# Altium schematic sheet 06_USB_Interface.SchDoc
size A4; SheetNumber: 7; SheetTotal: 9
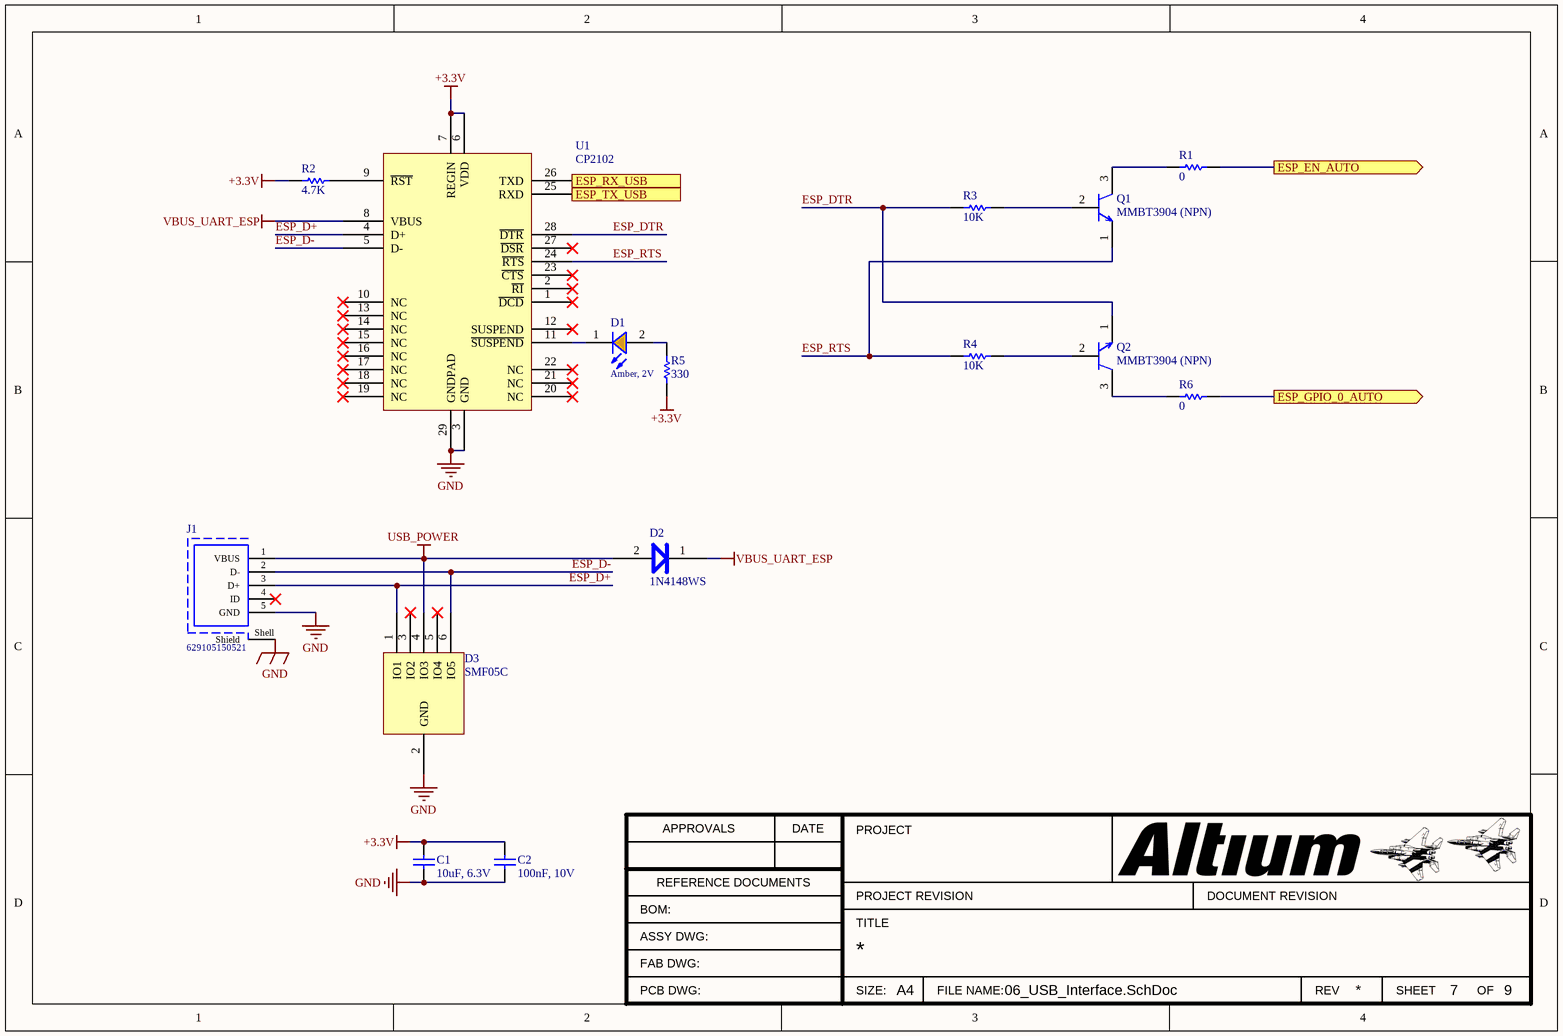
[diagram p0: 06_USB_Interface.SchDoc]

## Parts
C1  10uF, 6.3V  [WCAP-CSGP_0603_H=0.8mm_Reflow]
C2  100nF, 10V  [WCAP-CSGP_0603_H=0.8mm_Reflow]
D1  Amber, 2V  [WL-SMCW_0603_H=0.7mm]
D2  1N4148WS  [SODFL250X90-2N]
D3  SMF05C  [SOT65P210X110-6N]
J1  629105150521  [629105150521]
Q1  MMBT3904 (NPN)  [SOT95P245X110-3N]
Q2  MMBT3904 (NPN)  [SOT95P245X110-3N]
R1  value 0  [RES-SM-0603]  (hidden comment: RESISTOR SMD)
R2  value 4.7K  [RES-SM-0603]  (hidden comment: RESISTOR SMD)
R3  value 10K  [RES-SM-0603]  (hidden comment: RESISTOR SMD)
R4  value 10K  [RES-SM-0603]  (hidden comment: RESISTOR SMD)
R5  value 330  [RES-SM-0603]  (hidden comment: RESISTOR SMD)
R6  value 0  [RES-SM-0603]  (hidden comment: RESISTOR SMD)
U1  CP2102  [QFN50P500X500X90_HS-29N]

## Ports
ESP_EN_AUTO (out), ESP_GPIO_0_AUTO (out), ESP_RX_USB (out), ESP_TX_USB (in)

## Nets
+3.3V: C1.2 C2.2 R2.2 R5.2 U1.6(VDD) U1.7(REGIN)
GND: C1.1 C2.1 D3.2(GND) J1.5(GND) J1.Shell(Shield) U1.3(GND) U1.29(GNDPAD)
USB_POWER: D2.2 D3.4(IO3) J1.1(VBUS)
VBUS_UART_ESP: D2.1 U1.8(VBUS)
ESP_D+: D3.1(IO1) J1.3(D+) U1.4(D+)
ESP_D-: D3.6(IO5) J1.2(D-) U1.5(D-)
ESP_DTR: Q2.1 R3.1 U1.28(~{DTR})
ESP_EN_AUTO: R1.2 ; port ESP_EN_AUTO
ESP_GPIO_0_AUTO: R6.2 ; port ESP_GPIO_0_AUTO
ESP_RTS: Q1.1 R4.1 U1.24(~{RTS})
ESP_RX_USB: U1.26(TXD) ; port ESP_RX_USB
ESP_TX_USB: U1.25(RXD) ; port ESP_TX_USB
NetD1_1: D1.1(K) U1.11(~{SUSPEND})
NetD1_2: D1.2(A) R5.1
NetQ1_2: Q1.2 R3.2
NetQ1_3: Q1.3 R1.1
NetQ2_2: Q2.2 R4.2
NetQ2_3: Q2.3 R6.1
NetR2_1: R2.1 U1.9(~{RST})

Not connected (* = marked no-connect by the designer): D3 3(IO2)* 5(IO4)*; J1 4(ID)*; U1 1(~{DCD})* 2(~{RI})* 10(NC)* 12(SUSPEND)* 13(NC)* 14(NC)* 15(NC)* 16(NC)* 17(NC)* 18(NC)* 19(NC)* 20(NC)* 21(NC)* 22(NC)* 23(~{CTS})* 27(~{DSR})*

## Notes on the sheet
- APPROVALS
- DATE
- PROJECT
- BOM:
- REFERENCE DOCUMENTS
- TITLE
- PROJECT REVISION
- DOCUMENT REVISION
- ASSY DWG:
- FAB DWG:
- PCB DWG:
- SIZE:
- A4
- FILE NAME:
- REV
- SHEET
- OF

## Library data of the parts
C1 = 885012106006: WCAP-CSGP Multilayer Ceramic Chip Capacitor, General Purpose, size 0603, X5R, 10uF, 6.3V; Manufacturer: Wurth Elektronik; Rated Voltage: 6.3VDC; Isolation Resistance: >=0.01GOhm; Capacitance Tolerance: +/-20%; Technical Reference: X5R0603106M6R3DFCT10000; ComponentLink1Description: Manufacturer; ComponentLink1URL: http://www.we-online.de; ComponentLink2Description: Datasheet; ComponentLink2URL: https://www.we-online.com/catalog/datasheet/885012106006.pdf; Operating Temperature: -55 to +85degC; Packaging: Tape and Reel; Manufacturer Part Number: 885012106006; Published Date: May 2020; Ceramic Type: X5R; Dissipation Factor: =<10%; Height: 0.8mm; Mounting Technology: SMT; Size: 0603; Capacitance: 10uF
C2 = 885012206020: WCAP-CSGP Multilayer Ceramic Chip Capacitor, General Purpose, size 0603, X7R, 100nF, 10V; Manufacturer: Wurth Elektronik; Rated Voltage: 10VDC; Isolation Resistance: >=5GOhm; Capacitance Tolerance: +/-10%; Technical Reference: X7R0603104K010DFCT10000; ComponentLink1Description: Manufacturer; ComponentLink1URL: http://www.we-online.de; ComponentLink2Description: Datasheet; ComponentLink2URL: https://www.we-online.com/catalog/datasheet/885012206020.pdf; Operating Temperature: -55 to +125degC; Packaging: Tape and Reel; Manufacturer Part Number: 885012206020; Published Date: May 2020; Ceramic Type: X7R; Dissipation Factor: =<5%; Height: 0.8mm; Mounting Technology: SMT; Size: 0603; Capacitance: 100nF
D1 = 150060AS75000: WL-SMCW SMT Mono-color Chip LED Waterclear, size 0603, Amber, 2V, 140deg; Chip Technology: AlInGaP; Dominant Wavelength typ.: 605nm; Luminous Intensity typ.: 130mcd; Peak Wavelength typ.: 610nm; Viewing Angle: 140deg; ComponentLink1Description: Manufacturer; ComponentLink1URL: http://www.we-online.de; ComponentLink2URL: https://www.we-online.com/catalog/datasheet/150060AS75000.pdf; ComponentLink2Description: Datasheet; Forward Voltage typ.: 2V; Emitting Color: Amber; Mounting Technology: SMT; Operating Temperature: -40 to +85degC; Published Date: December 2019; Part Number: 150060AS75000; Packaging: Tape and Reel; Size: 0603; Publisher: Wurth Elektronik
J1 = 629105150521: Micro USB 2.0 Type B Receptacle WR-COM, Horizontal, SMT, with Pegs, High Current at Pin 1 & Pin 5; Rated Current: 3 A; Contact Resistance: 30 mOhm; Working Voltage: 30 VAC; ComponentLink1Description: Manufacturer; ComponentLink1URL: http://www.we-online.de; ComponentLink2Description: Datasheet; ComponentLink2URL: https://katalog.we-online.de/em/datasheet/629105150521.pdf; Part Number: 629105150521; Published Date: September 2018; Publisher: Wurth Elektronik; Orientation: Horizontal; Connector Type: Micro USB 2.0 Type B; Operating Temperature: -40 to 85 degC; Mounting Technology: SMT; Gender: Receptacle; Packaging: Tape and Reel
Q1 Q2 = MMBT3904 (NPN): Manufacturer: On Semiconductor; ComponentLink1Description: Local link; ComponentLink1URL: https://www.thegioiic.com/products/mmbt3904-1am; Local supplier: thegioiic; Local supplier PN: MMBT3904-1AM; Manufacturer P/N: MMBT3904
R1-R6 = RESISTOR SMD: Resistor